# EAGLE schematic SCH1 (EAGLE 7.6.0)
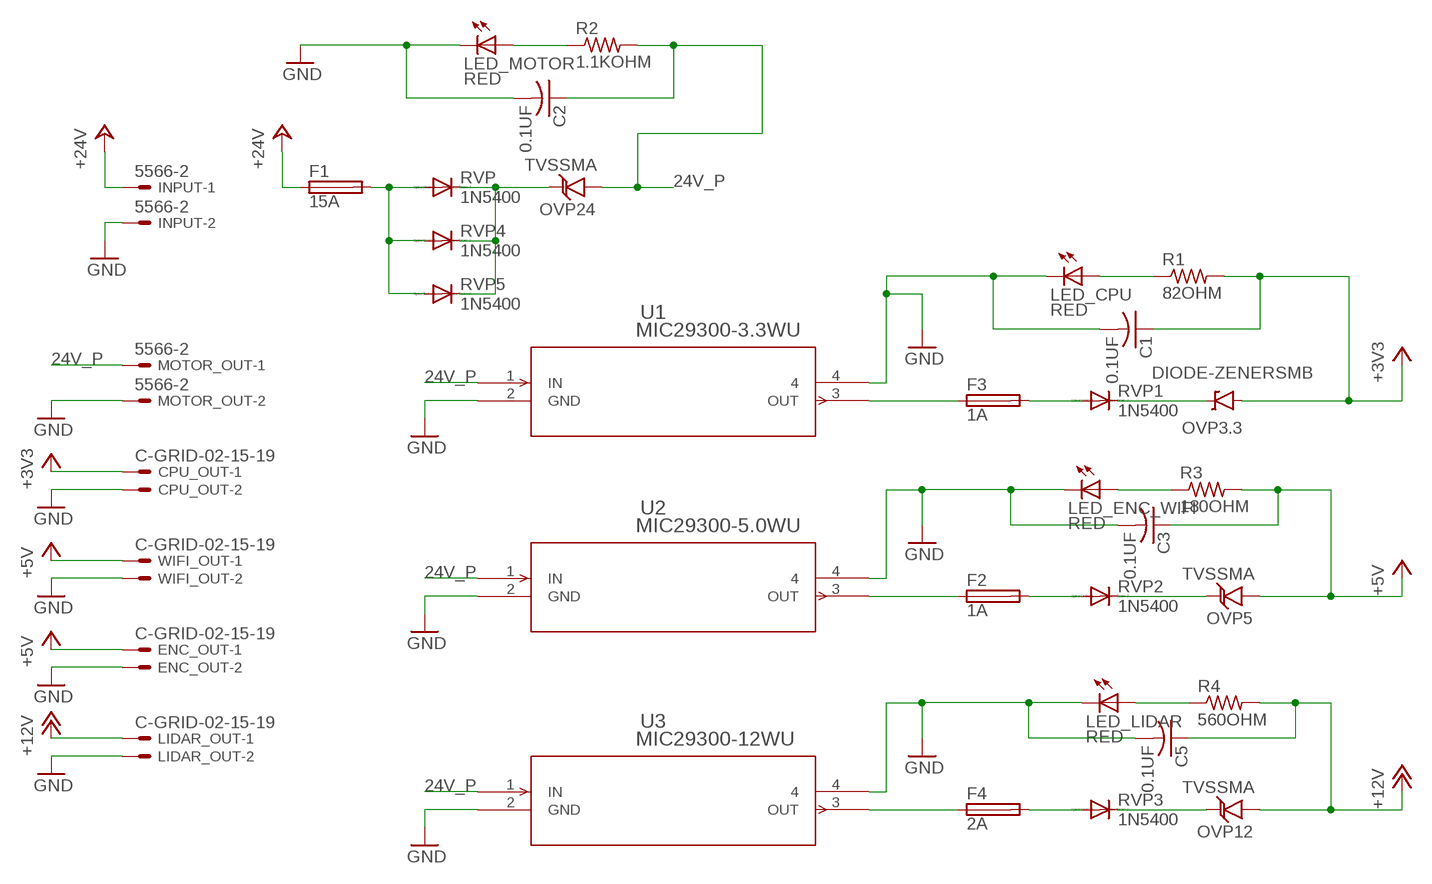
[diagram p0: schematic, sheet 1]

## Parts
C1  0.1UF  C-USC1206  [C1206]
C2  0.1UF  C-USC1206  [C1206]
C3  0.1UF  C-USC1206  [C1206]
C5  0.1UF  C-USC1206  [C1206]
CPU_OUT  C-GRID-02-15-19  [15-91-02]
ENC_OUT  C-GRID-02-15-19  [15-91-02]
F1  15A  TE5  [TE5]
F2  1A  TE5  [TE5]
F3  1A  TE5  [TE5]
F4  2A  TE5  [TE5]
INPUT  5566-2  [5566-2]
LED_CPU  RED  LEDSMT1206  [1206]
LED_ENC_WIFI  RED  LEDSMT1206  [1206]
LED_LIDAR  RED  LEDSMT1206  [1206]
LED_MOTOR  RED  LEDSMT1206  [1206]
LIDAR_OUT  C-GRID-02-15-19  [15-91-02]
MOTOR_OUT  5566-2  [5566-2]
OVP3.3  DIODE-ZENERSMB  [SMB-DIODE]
OVP5  TVSSMA  [SMA-DIODE]
OVP12  TVSSMA  [SMA-DIODE]
OVP24  TVSSMA  [SMA-DIODE]
R1  82OHM  R-US_R1206W  [R1206W]
R2  1.1KOHM  R-US_R1206W  [R1206W]
R3  180OHM  R-US_R1206W  [R1206W]
R4  560OHM  R-US_R1206W  [R1206W]
RVP  1N5400  [DO201-15]
RVP1  1N5400  [DO201-15]
RVP2  1N5400  [DO201-15]
RVP3  1N5400  [DO201-15]
RVP4  1N5400  [DO201-15]
RVP5  1N5400  [DO201-15]
U1  MIC29300-3.3WU  [TO-263-3]
U2  MIC29300-5.0WU  [TO-263-3]
U3  MIC29300-12WU  [TO-263-3]
WIFI_OUT  C-GRID-02-15-19  [15-91-02]

## Nets
24V_P: C2.1 MOTOR_OUT.1 OVP24.A R2.2 U1.1(IN) U2.1(IN) U3.1(IN)
+3V3: C1.1 CPU_OUT.1 OVP3.3.A R1.2
+5V: C3.1 ENC_OUT.1 OVP5.A R3.2 WIFI_OUT.1
+12V: C5.1 LIDAR_OUT.1 OVP12.A R4.2
+24V: F1.1 INPUT.1
GND: C1.2 C2.2 C3.2 C5.2 CPU_OUT.2 ENC_OUT.2 INPUT.2 LED_CPU.C LED_ENC_WIFI.C LED_LIDAR.C LED_MOTOR.C LIDAR_OUT.2 MOTOR_OUT.2 U1.2(GND) U1.4 U2.2(GND) U2.4 U3.2(GND) U3.4 WIFI_OUT.2
N$1: F1.2 RVP4.A RVP5.A RVP.A
N$2: OVP24.C RVP4.C RVP5.C RVP.C
N$3: F3.1 U1.3(OUT)
N$4: F2.1 U2.3(OUT)
N$5: F4.1 U3.3(OUT)
N$6: F3.2 RVP1.A
N$7: F2.2 RVP2.A
N$8: F4.2 RVP3.A
N$9: OVP3.3.C RVP1.C
N$10: OVP5.C RVP2.C
N$11: OVP12.C RVP3.C
N$12: LED_CPU.A R1.1
N$14: LED_MOTOR.A R2.1
N$15: LED_ENC_WIFI.A R3.1
N$16: LED_LIDAR.A R4.1

## Library data of the parts
C1-C3 C5 = adafruit:C-US: CAPACITOR, American symbol
CPU_OUT ENC_OUT LIDAR_OUT WIFI_OUT = con-molex:C-GRID-02: CONNECTOR wire to board 2.54 mm (0.100") pitch header; OC_FARNELL: unknown; OC_NEWARK: unknown
F1-F4 = fuse:TE5: FUSE Wickmann; OC_FARNELL: unknown; OC_NEWARK: unknown
INPUT MOTOR_OUT = con-molex:5566-2: Mini FIT connector 2 pol Source: http://www.molex.com; OC_FARNELL: 1822072; OC_NEWARK: unknown
LED_CPU LED_ENC_WIFI LED_LIDAR LED_MOTOR = adafruit:LED: LED OSRAM: - CHIPLED LG R971, LG N971, LY N971, LG Q971, LY Q971, LO R971, LY R971 LH N974, LH R974 LS Q976, LO Q976, LY Q976 LO Q996 - Hyper CHIPLED LW Q18S LB Q993, LB Q99A, LB R99A - SideLED LS A670, LO A670, LY A670, LG A670, LP A670 LB A673, LV A673, LT A673, LW A673 LH A674 LY A675 LS A676, LA A676, LO A676, LY A676, LW A676 LS A679, LY A679, LG A679 - Hyper Micro SIDELED® LS Y876, LA Y876, LO Y876, LY Y876 LT Y87S - SmartLED LW L88C, LW L88S LB L89C, LB L89S, LG L890 LS L89K, LO L89K, LY L89K LS L896, LA L896, LO L896, LY L896 - TOPLED LS T670, LO T670, LY T670, LG T670, LP T670 LSG T670, LSP T670, LSY T670, LOP T670, LYG T670 LG T671, LOG T671, LSG T671 LB T673, LV T673, LT T673, LW T673 LH T674 LS T676, LA T676, LO T676, LY T676, LB T676, LH T676, LSB T676, LW T676 LB T67C, LV T67C, LT T67C, LS T67K, LO T67K, LY T67K, LW E67C LS E67B, LA E67B, LO E67B, LY E67B, LB E67C, LV E67C, LT E67C LW T67C LS T679, LY T679, LG T679 LS T770, LO T770, LY T770, LG T770, LP T770 LB T773, LV T773, LT T773, LW T773 LH T774 LS E675, LA E675, LY E675, LS T675 LS T776, LA T776, LO T776, LY T776, LB T776 LHGB T686 LT T68C, LB T68C - Hyper Mini TOPLED® LB M676 - Mini TOPLED Santana® LG M470 LS M47K, LO M47K, LY M47K Source: http://www.osram.convergy.de/
OVP3.3 = SparkFun-DiscreteSemi:DIODE-ZENER: Zener Diode Production Part - 8199 3.4V Zener Voltage
OVP5 OVP12 OVP24 = SparkFun-DiscreteSemi:TVS: Transient voltage suppressor- prevents ESD on inputs.
R1-R4 = resistor:R-US_: RESISTOR, American symbol
RVP RVP1-RVP5 = diode:1N5400: DIODE standard rectifier, 3 A, 50 V (Motorola)
U1 = MIC29300-5WU:MIC29300-3.3WU; COPYRIGHT: Copyright (C) 2015 Accelerated Designs. All rights reserved; MANUFACTURER_PART_NUMBER: mic29300-3.3wu; VENDOR: MICREL
U2 = MIC29300-5WU:MIC29300-5.0WU; COPYRIGHT: Copyright (C) 2015 Accelerated Designs. All rights reserved; MANUFACTURER_PART_NUMBER: mic29300-5.0wu; VENDOR: MICREL
U3 = MIC29300-5WU:MIC29300-12WU; COPYRIGHT: Copyright (C) 2015 Accelerated Designs. All rights reserved; MANUFACTURER_PART_NUMBER: mic29300-12wu; VENDOR: MICREL